# EAGLE design w550io_Teensy_DMX (EAGLE 7.7.0)
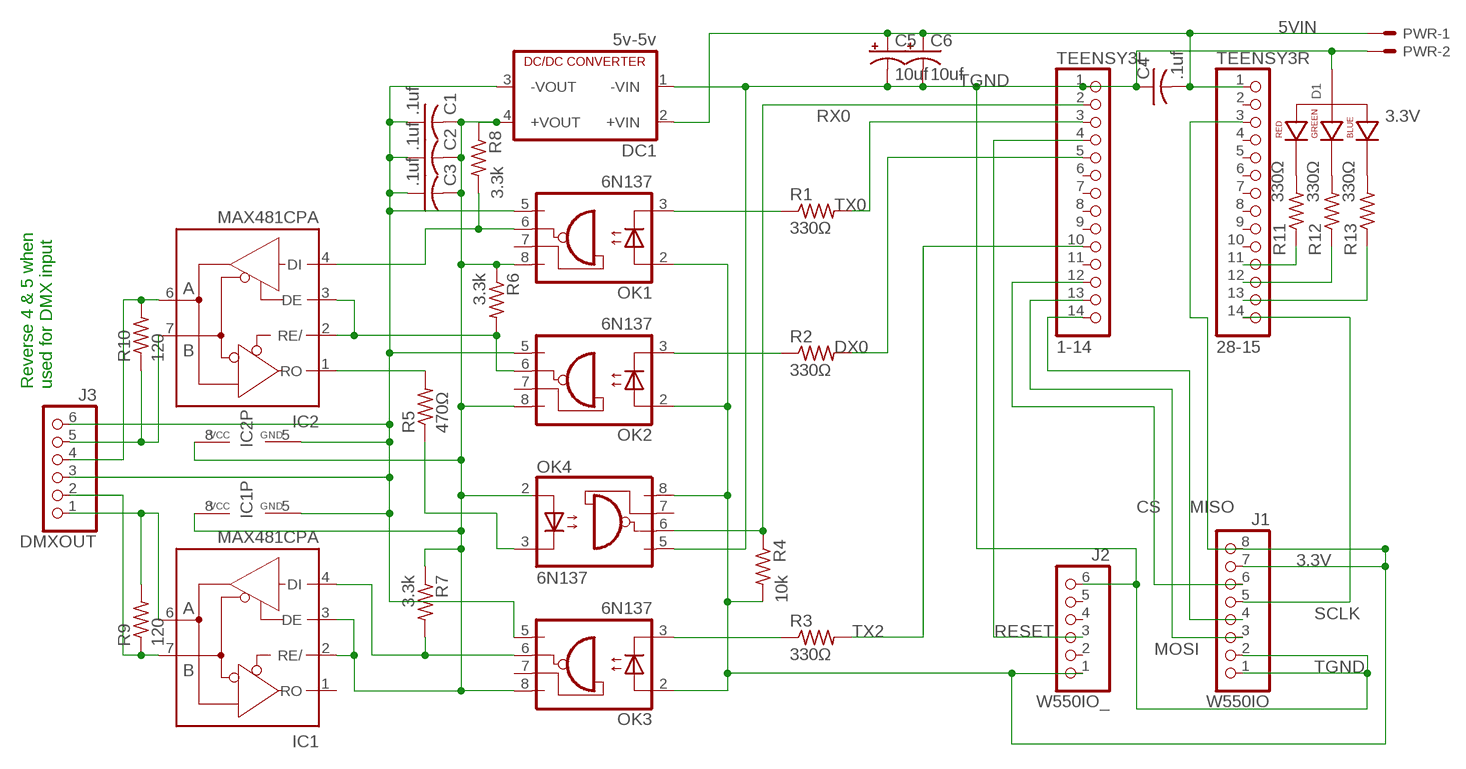
[diagram p0: schematic, sheet 1]

## Parts
C1  .1uf  C-US050-024X044  [C050-024X044]
C2  .1uf  C-US050-024X044  [C050-024X044]
C3  .1uf  C-US050-024X044  [C050-024X044]
C4  .1uf  C-US050-024X044  [C050-024X044]
C5  10uf  CPOL-USB45181B  [B45181B]
C6  10uf  CPOL-USB45181B  [B45181B]
D1  LED-RGB-CA-THRUCLEAR  [LED-RGB-THRU]
DC1  5v-5v  NME  [NME]
DMXOUT  J3  PINHD-1X6B  [1X06-BIG]
IC1  MAX481CPA  [DIL08]
IC2  MAX481CPA  [DIL08]
OK1  6N137  [DIL08]
OK2  6N137  [DIL08]
OK3  6N137  [DIL08]
OK4  6N137  [DIL08]
PWR  22-23-2021  [22-23-2021]
R1  330Ω  R-US_0204/5  [0204/5]
R2  330Ω  R-US_0204/5  [0204/5]
R3  330Ω  R-US_0204/5  [0204/5]
R4  10k  R-US_0204/5  [0204/5]
R5  470Ω  R-US_0204/5  [0204/5]
R6  3.3k  R-US_0204/5  [0204/5]
R7  3.3k  R-US_0204/5  [0204/5]
R8  3.3k  R-US_0204/5  [0204/5]
R9  120  R-US_0204/5  [0204/5]
R10  120  R-US_0204/5  [0204/5]
R11  330Ω  R-US_0204/5  [0204/5]
R12  330Ω  R-US_0204/5  [0204/5]
R13  330Ω  R-US_0204/5  [0204/5]
TEENSY3L  1-14  PINHD-1X14  [1X14]
TEENSY3R  28-15  PINHD-1X14  [1X14]
W550IO  J1  PINHD-1X8BIG  [1X08-BIG]
W550IO_  J2  PINHD-1X6B  [1X06-BIG]

## Nets
3.3V: OK1.2(A) OK2.2(A) OK3.2(A) OK4.8(VCC) R4.2 TEENSY3R.3 W550IO.7 W550IO.8 W550IO_.1
5VIN: C4.2 C5.+ C6.+ DC1.2(+VIN) PWR.1 TEENSY3R.1
CS: TEENSY3L.12 W550IO.6
DX0: R2.2 TEENSY3L.5
GND: C1.1 C2.1 C3.1 DC1.3(-VOUT) DMXOUT.3 DMXOUT.6 IC1.5(GND) IC2.5(GND) OK1.5(GND) OK2.5(GND) OK3.5(GND)
MISO: TEENSY3L.14 W550IO.4
MOSI: TEENSY3L.13 W550IO.3
N$1: OK4.3(C) R5.1
N$2: DMXOUT.4 IC2.6(A) R10.2
N$3: DMXOUT.1 IC1.6(A) R9.2
N$4: DMXOUT.2 IC1.7(B) R9.1
N$5: OK1.3(C) R1.1
N$6: OK2.3(C) R2.1
N$7: OK3.3(C) R3.1
N$8: IC1.4(DI) OK3.6(VO) R7.2
N$9: DMXOUT.5 IC2.7(B) R10.1
N$10: D1.1(RED_CATHODE) R11.2
N$11: D1.3(GREEN_CATHODE) R12.2
N$12: IC2.1(RO) R5.2
N$13: IC2.2(RE/) IC2.3(DE) OK2.6(VO) R6.2
N$14: IC2.4(DI) OK1.6(VO) R8.2
N$15: D1.4(BLUE_CATHODE) R13.2
N$16: R13.1 TEENSY3R.13
N$17: R12.1 TEENSY3R.12
N$18: R11.1 TEENSY3R.11
RESET: TEENSY3L.4 W550IO_.3
RX0: OK4.6(VO) R4.1 TEENSY3L.2
SCLK: TEENSY3R.14 W550IO.5
TGND: C4.1 C5.- C6.- D1.2(ANODE) DC1.1(-VIN) OK4.5(GND) PWR.2 TEENSY3L.1 W550IO.1 W550IO.2 W550IO_.6
TX0: R1.2 TEENSY3L.3
TX2: R3.2 TEENSY3L.10
VCC: C1.2 C2.2 C3.2 DC1.4(+VOUT) IC1.2(RE/) IC1.3(DE) IC1.8(VCC) IC2.8(VCC) OK1.8(VCC) OK2.8(VCC) OK3.8(VCC) OK4.2(A) R6.1 R7.1 R8.1
Unconnected: IC1.1(RO) OK1.7(VE) OK2.7(VE) OK3.7(VE) OK4.7(VE) TEENSY3L.6 TEENSY3L.7 TEENSY3L.8 TEENSY3L.9 TEENSY3L.11 TEENSY3R.2 TEENSY3R.4 TEENSY3R.5 TEENSY3R.6 TEENSY3R.7 TEENSY3R.8 TEENSY3R.9 TEENSY3R.10 W550IO_.2 W550IO_.4 W550IO_.5

## Notes on the sheet
- Reverse 4 & 5 when
  used for DMX input

## Library data of the parts
C1-C4 = adafruit:C-US: CAPACITOR, American symbol
C5 C6 = adafruit:CPOL-US: POLARIZED CAPACITOR, American symbol
D1 = SparkFun-LED:LED-RGB-CA-THRU: RGB Through-hole common anode SparkFun store front COM-10821 (diffuse) COM-10820 (clear); PROD_ID: DIO-10631
DC1 = dc-dc-converter:NME: DC-DC CONVERTER; MF: C & D TECHNOLOGIES, INC; MPN: NME1205D; OC_FARNELL: 1021466; OC_NEWARK: 98B8198
DMXOUT W550IO_ = adafruit:PINHD-1X6: PIN HEADER
IC1 IC2 = maxim:MAX481CPA: RS485 TRANSEIVER; MPN: MAX481CPA+; OC_FARNELL: unknown; OC_NEWARK: 99K3445
OK1-OK4 = optocoupler:6N137: MOTOROLA OPTO COUPLER; MPN: 6N137; OC_FARNELL: 1328376; OC_NEWARK: 52M1895
PWR = con-molex:22-23-2021: .100" (2.54mm) Center Header - 2 Pin; MF: MOLEX; MPN: 22-23-2021; OC_FARNELL: 1462926; OC_NEWARK: 25C3832
R1-R13 = adafruit:R-US_: RESISTOR, American symbol
TEENSY3L TEENSY3R = adafruit:PINHD-1X14: PIN HEADER
W550IO = adafruit:PINHD-1X8: PIN HEADER

## Board
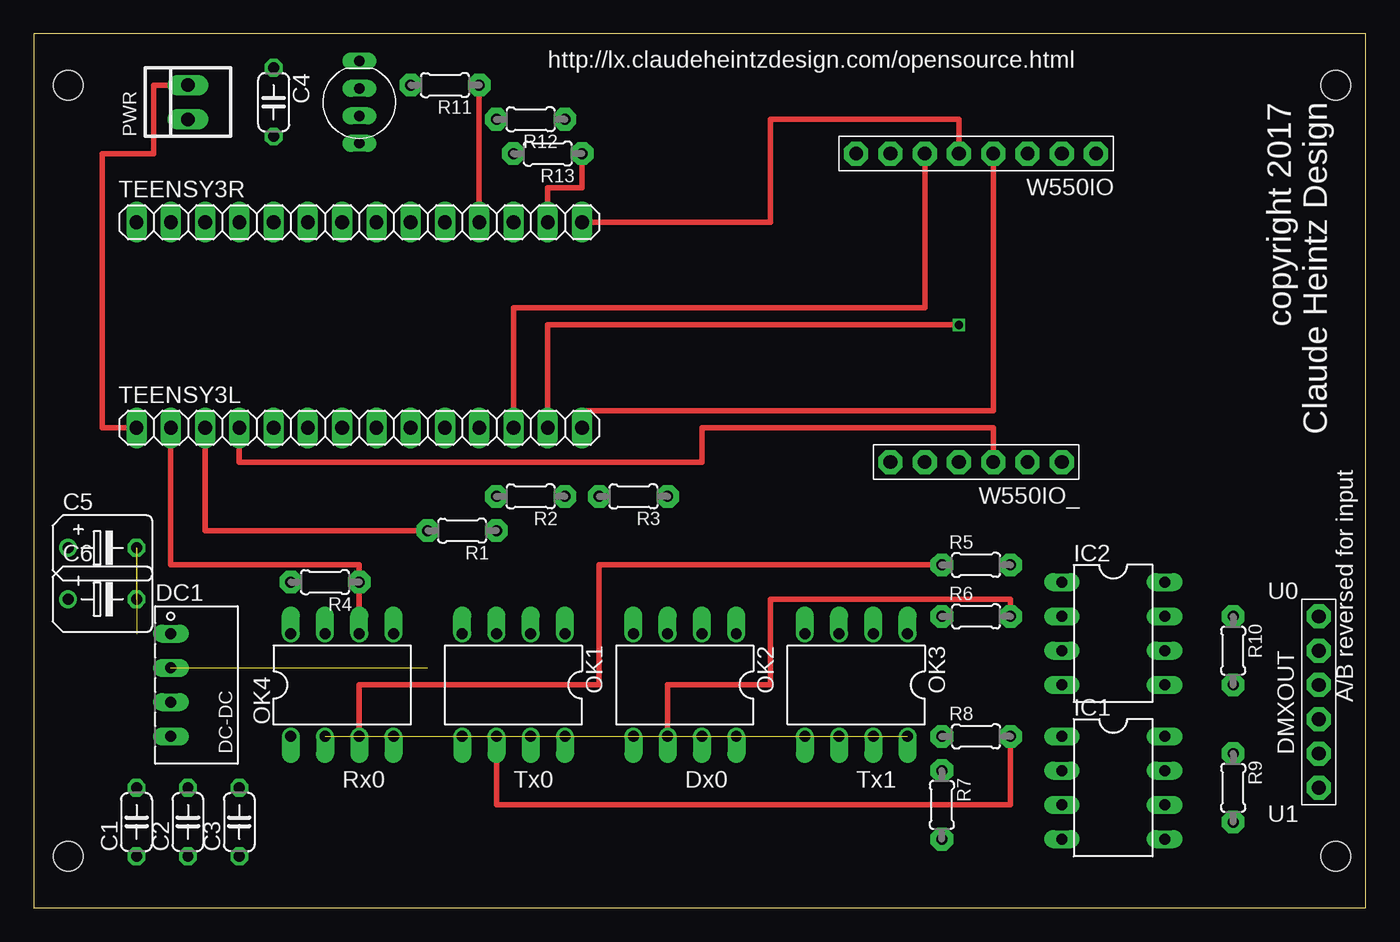
[diagram p1: board, top side]
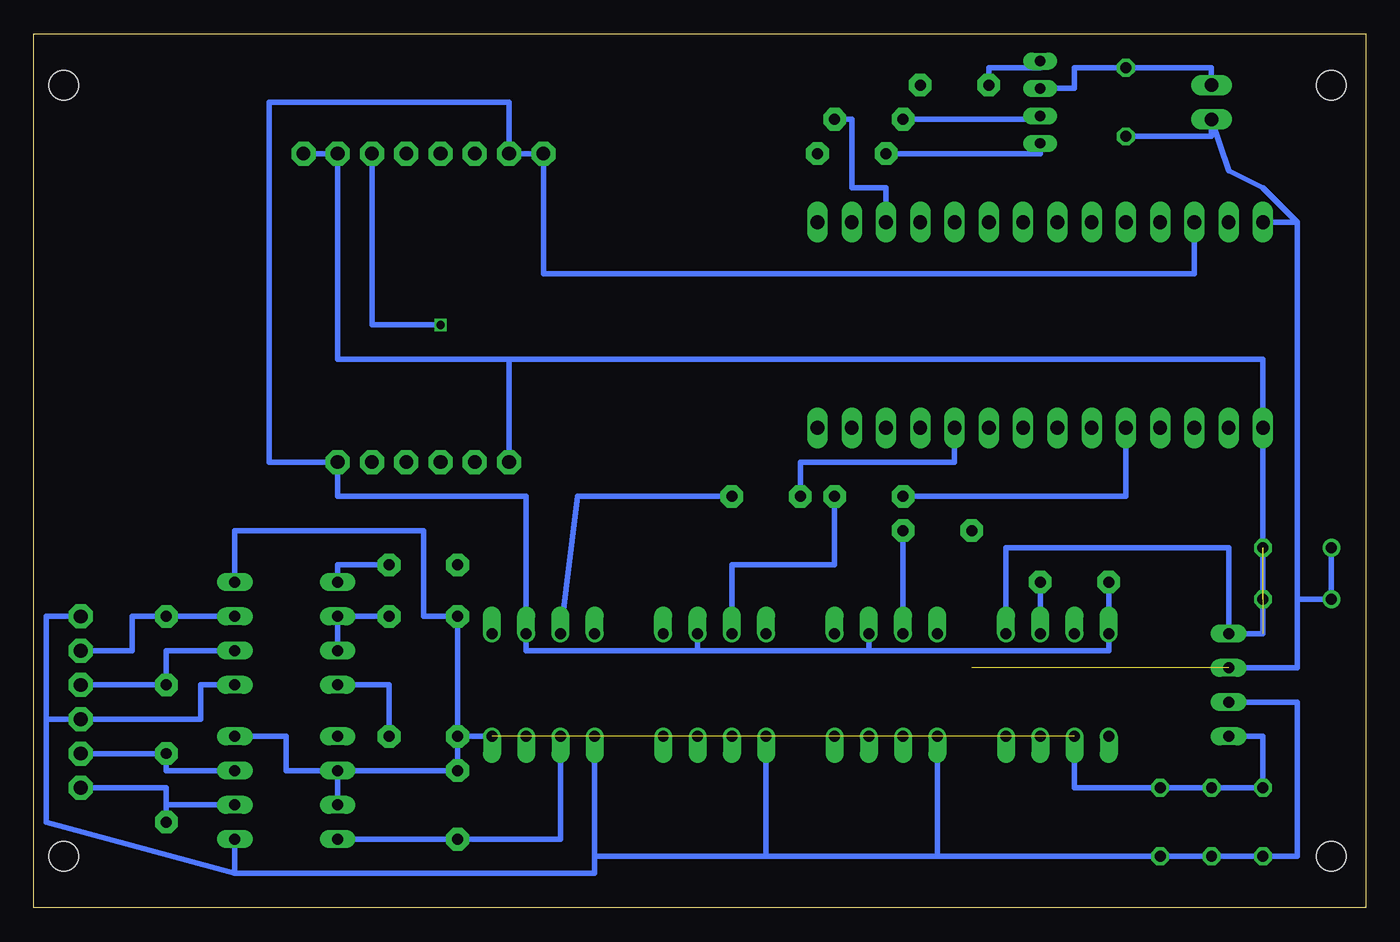
[diagram p2: board, bottom side, seen from below]

Size 98.73 x 64.76 mm. Coordinates in mm from the lower left corner, seen from the top.
Outline: 0,0 98.73,0 98.73,64.76 0,64.76 0,0
Copper layers (1*16): Top 0.035mm / dielectric 1.5mm / Bottom 0.035mm
Design rules "SeeedStudio_2layer_DRU_no_angle_20140221": minimum track width 6mil, minimum drill 12mil, track to track 6mil, track to pad 6mil, pad to pad 6mil, via to via 6mil, smd to smd 0mil, copper to edge 10mil, drill to drill 10mil, minimum pad ring 10mil, minimum via ring 6mil, stop-mask expansion 2mil, vias tented up to drill 100mil, thermal gap 10mil
Holes 2.2 mm at 2.54,3.81 96.52,3.81 96.52,60.96 2.54,60.96

### Footprints (pad centres in the part's own frame; a part is rotated, then mirrored left to right if it is on the bottom)
C050-024X044 = drill 0.813 octagon: 1 -2.54,0; 2 2.54,0
B45181B = drill 0.813: + -2.54,0 | drill 0.813 octagon: - 2.54,0
LED-RGB-THRU = drill 0.762 pad 0.889 long: 1 3.048,0; 2 1.016,0; 3 -1.016,0; 4 -3.048,0
NME = drill 0.813 long: 1 0,3.81; 2 0,1.27; 3 0,-1.27; 4 0,-3.81
1X06-BIG = drill 1.016 pad 1.778 octagon: 1 -6.35,0; 2 -3.81,0; 3 -1.27,0; 4 1.27,0; 5 3.81,0; 6 6.35,0
DIL08 = drill 0.813 long: 1 -3.81,-3.81; 2 -1.27,-3.81; 3 1.27,-3.81; 4 3.81,-3.81; 5 3.81,3.81; 6 1.27,3.81; 7 -1.27,3.81; 8 -3.81,3.81
DIL08' = drill 0.813 offset: 1 -3.81,-3.81; 2 -1.27,-3.81; 3 1.27,-3.81; 4 3.81,-3.81; 5 3.81,3.81; 6 1.27,3.81; 7 -1.27,3.81; 8 -3.81,3.81
22-23-2021 = drill 1 long: 1 -1.27,0; 2 1.27,0
0204/5 = drill 0.813 pad 1.676 octagon: 1 -2.54,0; 2 2.54,0
1X14 = drill 1.016 long: 1 -16.51,0; 2 -13.97,0; 3 -11.43,0; 4 -8.89,0; 5 -6.35,0; 6 -3.81,0; 7 -1.27,0; 8 1.27,0; 9 3.81,0; 10 6.35,0; 11 8.89,0; 12 11.43,0; 13 13.97,0; 14 16.51,0
1X08-BIG = drill 1.016 pad 1.778 octagon: 1 -8.89,0; 2 -6.35,0; 3 -3.81,0; 4 -1.27,0; 5 1.27,0; 6 3.81,0; 7 6.35,0; 8 8.89,0

### Placement (x,y rotation side)
C1  7.62,6.35 90 top
C2  11.43,6.35 90 top
C3  15.24,6.35 90 top
C4  17.78,59.69 270 top
C5  5.08,26.67 0 top
C6  5.08,22.86 0 top
D1  24.13,59.69 90 top
DC1  10.16,16.51 0 top
DMXOUT  95.25,15.24 90 top
IC1  80.01,8.89 270 top
IC2  80.01,20.32 270 top
OK1  6N137  [DIL08']  35.56,16.51 180 top
OK2  6N137  [DIL08']  48.26,16.51 180 top
OK3  6N137  [DIL08']  60.96,16.51 180 top
OK4  6N137  [DIL08']  22.86,16.51 0 top
PWR  11.43,59.69 90 top
R1  31.75,27.94 180 top
R2  36.83,30.48 180 top
R3  44.45,30.48 180 top
R4  21.59,24.13 180 top
R5  69.85,25.4 0 top
R6  69.85,21.59 0 top
R7  67.31,7.62 270 top
R8  69.85,12.7 0 top
R9  88.9,8.89 270 top
R10  88.9,19.05 270 top
R11  30.48,60.96 180 top
R12  36.83,58.42 180 top
R13  38.1,55.88 180 top
TEENSY3L  24.13,35.56 0 top
TEENSY3R  24.13,50.8 0 top
W550IO  69.85,55.88 180 top
W550IO_  69.85,33.02 180 top

### Tracks (layer width: path | path; a pad name or v marks a point on that pad's centre or on a via)
3.3V
  Bottom 0.406: TEENSY3R.3 12.7,46.99 60.96,46.99 W550IO.8 W550IO.7 63.5,59.69 81.28,59.69 81.28,33.02 W550IO_.1 76.2,30.48 62.23,30.48 OK3.2 62.23,19.05 49.53,19.05 | OK2.2 49.53,19.05 | 49.53,19.05 36.83,19.05 | OK1.2 36.83,19.05 | 36.83,19.05 19.05,19.05 OK4.8 R4.2
5VIN  (2 unrouted)
  Bottom 0.406: 5.08,50.8 5.08,22.86 | 5.08,22.86 5.08,17.78 DC1.2 | TEENSY3R.1 5.08,50.8 | 5.08,50.8 7.62,53.34 10.16,54.61 PWR.1 11.43,57.15 C4.2 | C5.+ C6.+ 5.08,22.86
CS
  Top 0.406: TEENSY3L.12 35.56,44.45 66.04,44.45 W550IO.6
DX0
  Bottom 0.406: R2.2 17.78,30.48 TEENSY3L.5
GND
  Bottom 0.406: DC1.3 5.08,15.24 5.08,3.81 C1.1 C2.1 C3.1 24.13,3.81 31.75,3.81 | 31.75,3.81 OK1.5 | OK2.5 44.45,3.81 | 44.45,3.81 31.75,3.81 | 57.15,3.81 44.45,3.81 | IC1.5 83.82,2.54 | 83.82,2.54 57.15,2.54 57.15,3.81 | 83.82,2.54 97.79,6.35 97.79,13.97 | 97.79,13.97 DMXOUT.3 86.36,13.97 86.36,16.51 IC2.5 | 97.79,13.97 97.79,21.59 DMXOUT.6 | OK3.5 57.15,3.81
MISO
  Top 0.406: W550IO.4 71.12,36.83 40.64,36.83 TEENSY3L.14
MOSI  (via drill 0.6)
  Top 0.406: v68.58,43.18 38.1,43.18 TEENSY3L.13
  Bottom 0.406: W550IO.3 73.66,43.18 v68.58,43.18
N$1  (1 unrouted)
  Top 0.406: R5.1 41.91,25.4 41.91,16.51 24.13,16.51 OK4.3
N$2
  Bottom 0.406: IC2.6 88.9,19.05 R10.2 DMXOUT.4
N$3
  Bottom 0.406: 88.9,7.62 R9.2 | IC1.6 88.9,7.62 | 88.9,7.62 88.9,8.89 DMXOUT.1
N$4
  Bottom 0.406: DMXOUT.2 R9.1 88.9,10.16 IC1.7
N$5
  Bottom 0.406: OK1.3 R1.1
N$6
  Bottom 0.406: OK2.3 46.99,25.4 39.37,25.4 R2.1
N$7
  Bottom 0.406: OK3.3 58.42,30.48 R3.1
N$8
  Bottom 0.406: IC1.4 R7.2 59.69,5.08 OK3.6
N$9
  Bottom 0.406: IC2.7 R10.1 91.44,21.59 91.44,19.05 DMXOUT.5
N$10
  Bottom 0.406: R11.2 27.94,62.23 24.13,62.23 D1.1
N$11
  Bottom 0.406: R12.2 24.13,58.42 D1.3
N$12
  Bottom 0.406: IC2.1 76.2,25.4 R5.2
N$13
  Top 0.406: R6.2 72.39,22.86 54.61,22.86 54.61,16.51 46.99,16.51 OK2.6
  Bottom 0.406: R6.2 IC2.2 IC2.3
N$14
  Top 0.406: R8.2 72.39,7.62 34.29,7.62 OK1.6
  Bottom 0.406: R8.2 72.39,16.51 IC2.4
N$15
  Bottom 0.406: R13.2 24.13,55.88 D1.4
N$16
  Top 0.406: TEENSY3R.13 38.1,53.34 40.64,53.34 R13.1
N$17
  Bottom 0.406: TEENSY3R.12 35.56,53.34 38.1,53.34 38.1,58.42 R12.1
N$18
  Top 0.406: TEENSY3R.11 R11.1
RESET
  Top 0.406: W550IO_.3 71.12,35.56 49.53,35.56 49.53,33.02 15.24,33.02 TEENSY3L.4
RX0
  Top 0.406: TEENSY3L.2 10.16,25.4 24.13,25.4 OK4.6
  Bottom 0.406: R4.1 OK4.6
SCLK
  Top 0.406: TEENSY3R.14 54.61,50.8 54.61,58.42 68.58,58.42 W550IO.5
TGND  (2 unrouted)
  Top 0.406: TEENSY3L.1 5.08,35.56 5.08,55.88 8.89,55.88 8.89,60.96 PWR.2
  Bottom 0.406: 63.5,40.64 7.62,40.64 TEENSY3L.1 7.62,20.32 DC1.1 10.16,26.67 26.67,26.67 OK4.5 | 63.5,40.64 76.2,40.64 W550IO.2 W550IO.1 | W550IO_.6 63.5,40.64 | PWR.2 11.43,62.23 C4.1 21.59,62.23 21.59,60.71 D1.2
TX0
  Top 0.406: R1.2 12.7,27.94 TEENSY3L.3
TX2
  Bottom 0.406: R3.2 41.91,33.02 30.48,33.02 TEENSY3L.10
VCC  (3 unrouted)
  Bottom 0.406: DC1.4 7.62,12.7 C1.2 C2.2 C3.2 21.59,8.89 OK4.2 | IC1.3 IC1.2 | OK3.8 R8.1 | R8.1 R6.1 69.85,21.59 69.85,27.94 83.82,27.94 IC2.8 | R8.1 R7.1 IC1.2 | IC1.2 80.01,10.16 80.01,12.7 IC1.8

### Text on the board
tNames: http://lx.claudeheintzdesign.com/opensource.html | copyright 2017 / Claude Heintz Design | U0 | A/B reversed for input | Rx0 | Tx0 | Dx0 | Tx1 | U1